# EAGLE design CS_PERF (EAGLE 9.5.0)
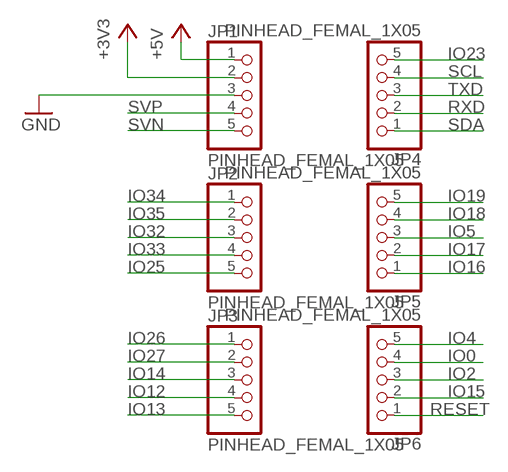
[diagram p0: schematic, sheet 1]

## Parts
JP1  PINHEAD_FEMAL_1X05  [1X05F]
JP2  PINHEAD_FEMAL_1X05  [1X05F]
JP3  PINHEAD_FEMAL_1X05  [1X05F]
JP4  PINHEAD_FEMAL_1X05  [1X05F]
JP5  PINHEAD_FEMAL_1X05  [1X05F]
JP6  PINHEAD_FEMAL_1X05  [1X05F]

## Nets
+3V3: JP1.2
+5V: JP1.1
GND: JP1.3
IO0: JP6.4
IO2: JP6.3
IO4: JP6.5
IO5: JP5.3
IO12: JP3.4
IO13: JP3.5
IO14: JP3.3
IO15: JP6.2
IO16: JP5.1
IO17: JP5.2
IO18: JP5.4
IO19: JP5.5
IO23: JP4.5
IO25: JP2.5
IO26: JP3.1
IO27: JP3.2
IO32: JP2.3
IO33: JP2.4
IO34: JP2.1
IO35: JP2.2
RESET: JP6.1
RXD: JP4.2
SCL: JP4.4
SDA: JP4.1
SVN: JP1.5
SVP: JP1.4
TXD: JP4.3

## Library data of the parts
JP1-JP6 = SamacSys_3D:PINHEAD_FEMAL_1X05

## Board
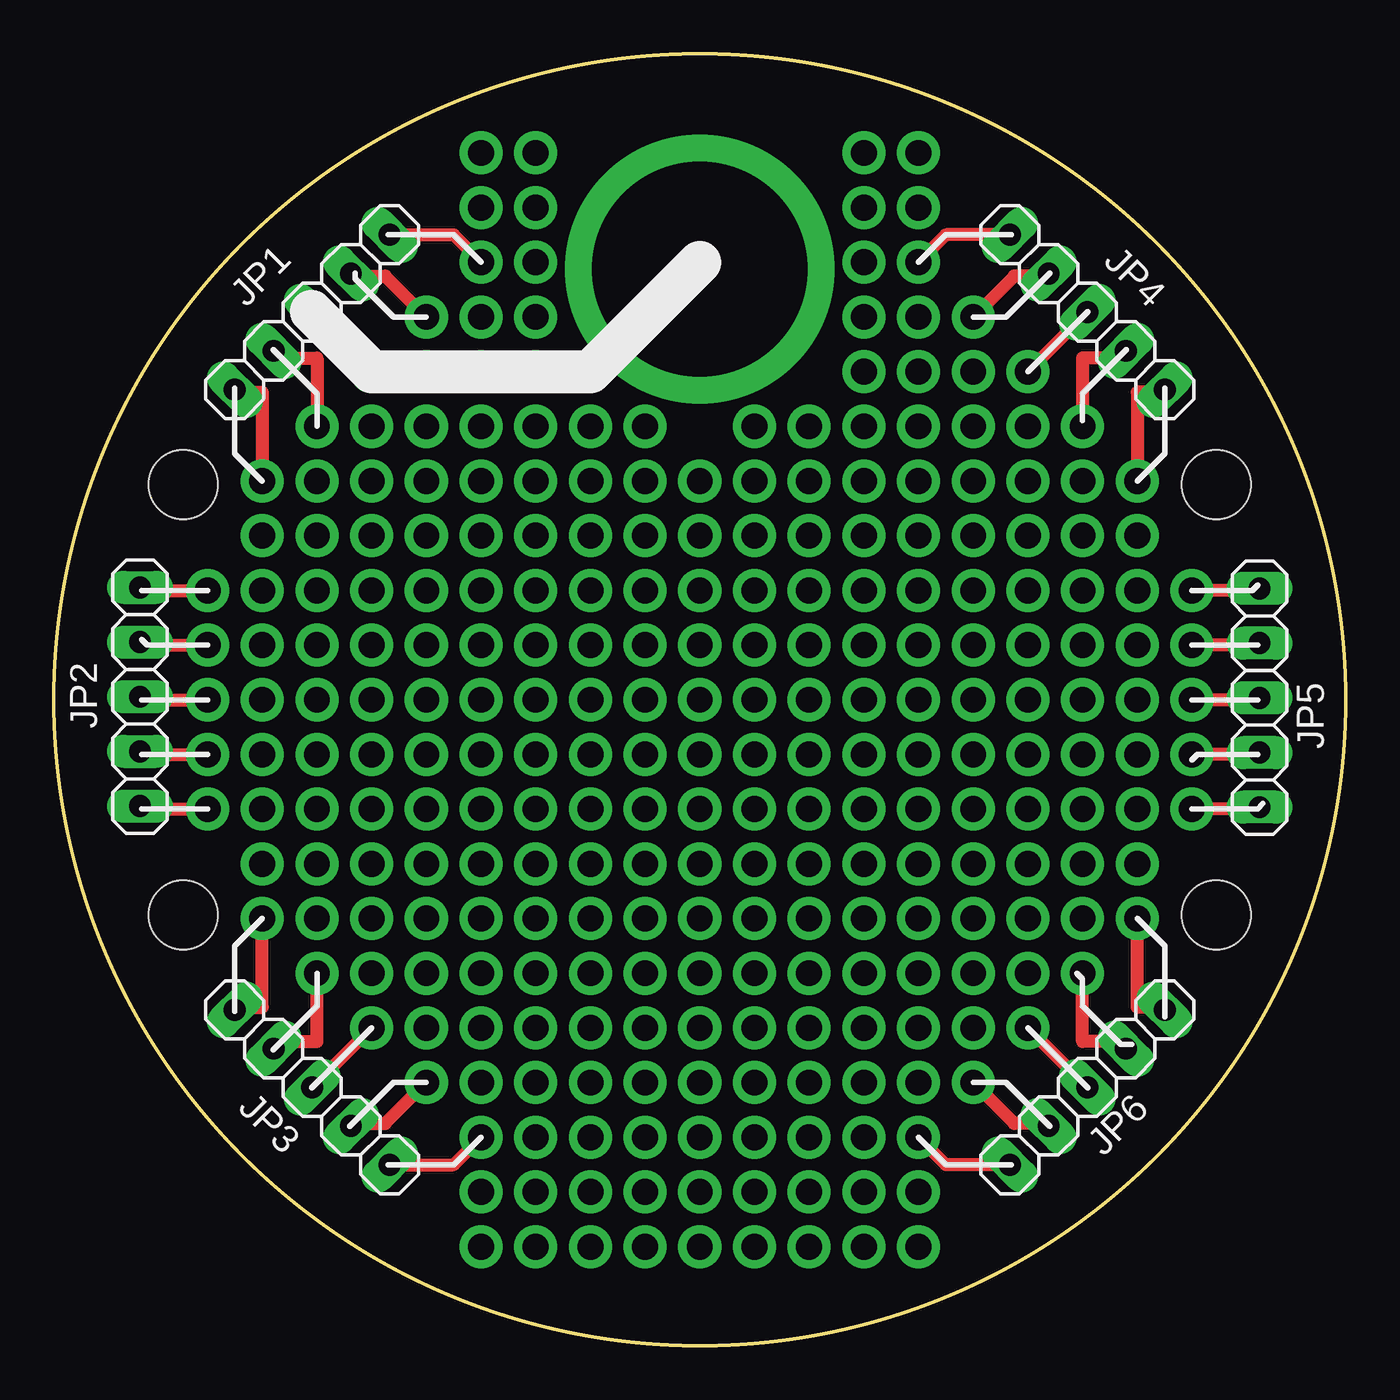
[diagram p1: board, top side]
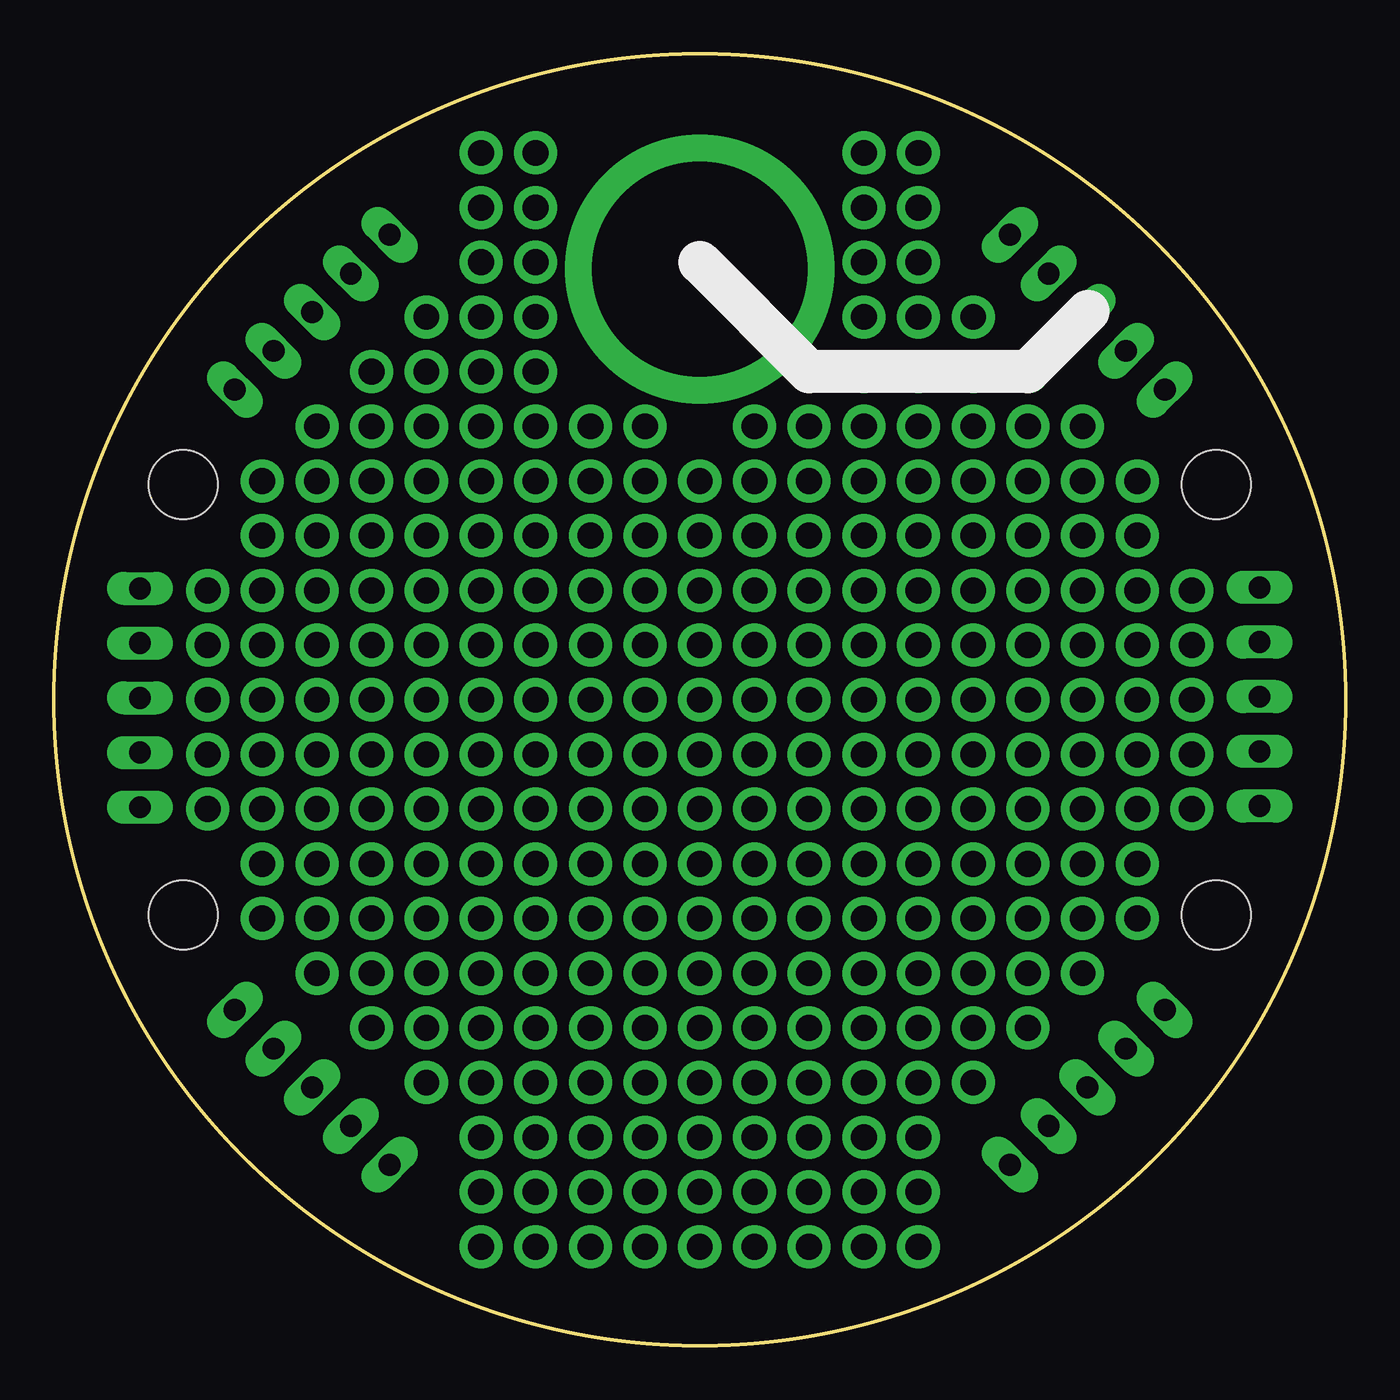
[diagram p2: board, bottom side, seen from below]

Size 60 x 60 mm. Coordinates in mm from the lower left corner, seen from the top.
Outline: circle at 30,30 radius 30
Copper layers (1*16): Top 0.035mm / dielectric 1.5mm / Bottom 0.035mm
Design rules "default *": minimum track width 0.6mm, minimum drill 0.35mm, track to track 10mil, track to pad 10mil, pad to pad 10mil, via to via 10mil, smd to smd 6mil, copper to edge 40mil, drill to drill 8mil, minimum pad ring 10mil, minimum via ring 8mil, stop-mask expansion 6mil, vias tented up to drill 0mil, thermal gap 8mil
Holes 3.2 mm at 6,40 54,40 6,20 54,20

### Footprints (pad centres in the part's own frame; a part is rotated, then mirrored left to right if it is on the bottom)
1X05F = drill 1.016 long: 1 -5.08,0; 2 -2.54,0; 3 0,0; 4 2.54,0; 5 5.08,0

### Placement (x,y rotation side)
JP1  12,48 225 top
JP2  4,30.14 270 top
JP3  12,12 315 top
JP4  48,48 135 top
JP5  56,30.09 90 top
JP6  48,12 45 top

### Tracks (layer width: path | path; a pad name or v marks a point on that pad's centre or on a via)
+3V3  (via drill 1.2 pad 2)
  Top 0.6: v17.3,47.78 15.39,49.69 13.81,49.69 JP1.2
+5V  (via drill 1.2 pad 2)
  Top 0.6: v19.84,50.32 18.57,51.59 15.71,51.59 JP1.1
GND  (via drill 1.2 pad 2, 10 pad 12.5)
  Top 0.6: v30,50 29.84,50.16
  Top 1: 30,50.32 29.84,50.16 24.92,45.24 v22.38,45.24 v19.84,45.24 v17.3,45.24 v14.76,45.24 JP1.3
  Bottom 1: 30,50.32 24.92,45.24 v22.38,45.24 v19.84,45.24 v17.3,45.24 v14.76,45.24 JP1.3
IO0  (via drill 1.2 pad 2)
  Top 0.6: v47.78,17.3 47.78,14.12 49.37,14.12 49.69,13.81 JP6.4
IO2  (via drill 1.2 pad 2)
  Top 0.6: JP6.3 v45.24,14.76
IO4  (via drill 1.2 pad 2)
  Top 0.6: v50.32,19.84 50.32,15.71 51.59,15.71 JP6.5
IO5  (via drill 1.2 pad 2)
  Top 0.6: v52.86,30 55.72,30 JP5.3
IO12  (via drill 1.2 pad 2)
  Top 0.6: v17.3,12.22 15.39,10.32 13.81,10.32 JP3.4
IO13  (via drill 1.2 pad 2)
  Top 0.6: v19.84,9.68 18.57,8.41 15.71,8.41 JP3.5
IO14  (via drill 1.2 pad 2)
  Top 0.6: JP3.3 v14.76,14.76
IO15  (via drill 1.2 pad 2)
  Top 0.6: v42.7,12.22 44.61,10.32 46.19,10.32 JP6.2
IO16  (via drill 1.2 pad 2)
  Top 0.6: v52.86,24.92 55.72,24.92 JP5.1
IO17  (via drill 1.2 pad 2)
  Top 0.6: v52.86,27.46 55.72,27.46 JP5.2
IO18  (via drill 1.2 pad 2)
  Top 0.6: v52.86,32.54 55.72,32.54 JP5.4
IO19  (via drill 1.2 pad 2)
  Top 0.6: v52.86,35.08 55.72,35.08 JP5.5
IO23  (via drill 1.2 pad 2)
  Top 0.6: v40.16,50.32 41.43,51.59 44.29,51.59 JP4.5
IO25  (via drill 1.2 pad 2)
  Top 0.6: v7.14,24.92 4.28,24.92 JP2.5
IO26  (via drill 1.2 pad 2)
  Top 0.6: v9.68,19.84 9.68,15.71 8.41,15.71 JP3.1
IO27  (via drill 1.2 pad 2)
  Top 0.6: v12.22,17.3 12.22,14.12 10.63,14.12 10.32,13.81 JP3.2
IO32  (via drill 1.2 pad 2)
  Top 0.6: v7.14,30 4.28,30 JP2.3
IO33  (via drill 1.2 pad 2)
  Top 0.6: v7.14,27.46 4.28,27.46 JP2.4
IO34  (via drill 1.2 pad 2)
  Top 0.6: v7.14,35.08 4.28,35.08 JP2.1
IO35  (via drill 1.2 pad 2)
  Top 0.6: v7.14,32.54 4.28,32.54 JP2.2
N$1  (via drill 1.2 pad 2)
  other vias: 30,30
N$3  (via drill 1.2 pad 2)
  other vias: 19.84,47.78
N$4  (via drill 1.2 pad 2)
  other vias: 32.54,30
N$5  (via drill 1.2 pad 2)
  other vias: 27.46,30
N$6  (via drill 1.2 pad 2)
  other vias: 30,27.46
N$7  (via drill 1.2 pad 2)
  other vias: 22.38,50.32
N$8  (via drill 1.2 pad 2)
  other vias: 22.38,47.78
N$9  (via drill 1.2 pad 2)
  other vias: 37.62,50.32
N$10  (via drill 1.2 pad 2)
  other vias: 37.62,47.78
N$11  (via drill 1.2 pad 2)
  other vias: 40.16,47.78
N$12  (via drill 1.2 pad 2)
  other vias: 37.62,45.24
N$13  (via drill 1.2 pad 2)
  other vias: 40.16,45.24
N$14  (via drill 1.2 pad 2)
  other vias: 42.7,45.24
N$15  (via drill 1.2 pad 2)
  other vias: 14.76,42.7
N$16  (via drill 1.2 pad 2)
  other vias: 17.3,42.7
N$17  (via drill 1.2 pad 2)
  other vias: 19.84,42.7
N$18  (via drill 1.2 pad 2)
  other vias: 22.38,42.7
N$19  (via drill 1.2 pad 2)
  other vias: 24.92,42.7
N$20  (via drill 1.2 pad 2)
  other vias: 27.46,42.7
N$22  (via drill 1.2 pad 2)
  other vias: 32.54,42.7
N$23  (via drill 1.2 pad 2)
  other vias: 35.08,42.7
N$24  (via drill 1.2 pad 2)
  other vias: 37.62,42.7
N$25  (via drill 1.2 pad 2)
  other vias: 40.16,42.7
N$26  (via drill 1.2 pad 2)
  other vias: 42.7,42.7
N$27  (via drill 1.2 pad 2)
  other vias: 45.24,42.7
N$28  (via drill 1.2 pad 2)
  other vias: 12.22,40.16
N$29  (via drill 1.2 pad 2)
  other vias: 14.76,40.16
N$30  (via drill 1.2 pad 2)
  other vias: 17.3,40.16
N$31  (via drill 1.2 pad 2)
  other vias: 19.84,40.16
N$32  (via drill 1.2 pad 2)
  other vias: 22.38,40.16
N$33  (via drill 1.2 pad 2)
  other vias: 24.92,40.16
N$34  (via drill 1.2 pad 2)
  other vias: 27.46,40.16
N$35  (via drill 1.2 pad 2)
  other vias: 30,40.16
N$36  (via drill 1.2 pad 2)
  other vias: 32.54,40.16
N$37  (via drill 1.2 pad 2)
  other vias: 35.08,40.16
N$38  (via drill 1.2 pad 2)
  other vias: 37.62,40.16
N$39  (via drill 1.2 pad 2)
  other vias: 40.16,40.16
N$40  (via drill 1.2 pad 2)
  other vias: 42.7,40.16
N$41  (via drill 1.2 pad 2)
  other vias: 45.24,40.16
N$42  (via drill 1.2 pad 2)
  other vias: 47.78,40.16
N$43  (via drill 1.2 pad 2)
  other vias: 9.68,37.62
N$44  (via drill 1.2 pad 2)
  other vias: 12.22,37.62
N$45  (via drill 1.2 pad 2)
  other vias: 9.68,35.08
N$46  (via drill 1.2 pad 2)
  other vias: 9.68,32.54
N$47  (via drill 1.2 pad 2)
  other vias: 9.68,30
N$48  (via drill 1.2 pad 2)
  other vias: 9.68,27.46
N$49  (via drill 1.2 pad 2)
  other vias: 9.68,24.92
N$50  (via drill 1.2 pad 2)
  other vias: 9.68,22.38
N$51  (via drill 1.2 pad 2)
  other vias: 12.22,19.84
N$52  (via drill 1.2 pad 2)
  other vias: 14.76,17.3
N$53  (via drill 1.2 pad 2)
  other vias: 17.3,14.76
N$54  (via drill 1.2 pad 2)
  other vias: 19.84,12.22
N$55  (via drill 1.2 pad 2)
  other vias: 22.38,9.68
N$56  (via drill 1.2 pad 2)
  other vias: 24.92,9.68
N$57  (via drill 1.2 pad 2)
  other vias: 27.46,9.68
N$58  (via drill 1.2 pad 2)
  other vias: 30,9.68
N$59  (via drill 1.2 pad 2)
  other vias: 32.54,9.68
N$60  (via drill 1.2 pad 2)
  other vias: 35.08,9.68
N$61  (via drill 1.2 pad 2)
  other vias: 37.62,9.68
N$62  (via drill 1.2 pad 2)
  other vias: 40.16,12.22
N$63  (via drill 1.2 pad 2)
  other vias: 42.7,14.76
N$64  (via drill 1.2 pad 2)
  other vias: 45.24,17.3
N$65  (via drill 1.2 pad 2)
  other vias: 47.78,19.84
N$66  (via drill 1.2 pad 2)
  other vias: 50.32,22.38
N$67  (via drill 1.2 pad 2)
  other vias: 50.32,24.92
N$68  (via drill 1.2 pad 2)
  other vias: 50.32,27.46
N$69  (via drill 1.2 pad 2)
  other vias: 50.32,30
N$70  (via drill 1.2 pad 2)
  other vias: 50.32,32.54
N$71  (via drill 1.2 pad 2)
  other vias: 50.32,35.08
N$72  (via drill 1.2 pad 2)
  other vias: 50.32,37.62
N$73  (via drill 1.2 pad 2)
  other vias: 19.84,7.14
N$74  (via drill 1.2 pad 2)
  other vias: 19.84,4.6
N$75  (via drill 1.2 pad 2)
  other vias: 22.38,4.6
N$76  (via drill 1.2 pad 2)
  other vias: 24.92,4.6
N$77  (via drill 1.2 pad 2)
  other vias: 27.46,4.6
N$78  (via drill 1.2 pad 2)
  other vias: 30,4.6
N$79  (via drill 1.2 pad 2)
  other vias: 32.54,4.6
N$80  (via drill 1.2 pad 2)
  other vias: 35.08,4.6
N$81  (via drill 1.2 pad 2)
  other vias: 37.62,4.6
N$82  (via drill 1.2 pad 2)
  other vias: 40.16,4.6
N$83  (via drill 1.2 pad 2)
  other vias: 40.16,7.14
N$84  (via drill 1.2 pad 2)
  other vias: 37.62,7.14
N$85  (via drill 1.2 pad 2)
  other vias: 35.08,7.14
N$86  (via drill 1.2 pad 2)
  other vias: 30,7.14
N$87  (via drill 1.2 pad 2)
  other vias: 24.92,7.14
N$88  (via drill 1.2 pad 2)
  other vias: 22.38,7.14
N$89  (via drill 1.2 pad 2)
  other vias: 27.46,7.14
N$90  (via drill 1.2 pad 2)
  other vias: 32.54,7.14
N$91  (via drill 1.2 pad 2)
  other vias: 22.38,52.86
N$92  (via drill 1.2 pad 2)
  other vias: 19.84,52.86
N$93  (via drill 1.2 pad 2)
  other vias: 37.62,52.86
N$94  (via drill 1.2 pad 2)
  other vias: 40.16,52.86
N$95  (via drill 1.2 pad 2)
  other vias: 40.16,55.4
N$96  (via drill 1.2 pad 2)
  other vias: 37.62,55.4
N$97  (via drill 1.2 pad 2)
  other vias: 22.38,55.4
N$98  (via drill 1.2 pad 2)
  other vias: 19.84,55.4
N$101  (via drill 1.2 pad 2)
  other vias: 47.78,37.62
N$102  (via drill 1.2 pad 2)
  other vias: 47.78,35.08
N$103  (via drill 1.2 pad 2)
  other vias: 47.78,32.54
N$104  (via drill 1.2 pad 2)
  other vias: 47.78,27.46
N$105  (via drill 1.2 pad 2)
  other vias: 47.78,30
N$106  (via drill 1.2 pad 2)
  other vias: 47.78,24.92
N$107  (via drill 1.2 pad 2)
  other vias: 47.78,22.38
N$108  (via drill 1.2 pad 2)
  other vias: 14.76,37.62
N$109  (via drill 1.2 pad 2)
  other vias: 17.3,37.62
N$110  (via drill 1.2 pad 2)
  other vias: 19.84,37.62
N$111  (via drill 1.2 pad 2)
  other vias: 22.38,37.62
N$112  (via drill 1.2 pad 2)
  other vias: 24.92,37.62
N$113  (via drill 1.2 pad 2)
  other vias: 27.46,37.62
N$114  (via drill 1.2 pad 2)
  other vias: 30,37.62
N$115  (via drill 1.2 pad 2)
  other vias: 32.54,37.62
N$116  (via drill 1.2 pad 2)
  other vias: 35.08,37.62
N$117  (via drill 1.2 pad 2)
  other vias: 37.62,37.62
N$118  (via drill 1.2 pad 2)
  other vias: 40.16,37.62
N$119  (via drill 1.2 pad 2)
  other vias: 42.7,37.62
N$120  (via drill 1.2 pad 2)
  other vias: 45.24,37.62
N$121  (via drill 1.2 pad 2)
  other vias: 45.24,35.08
N$122  (via drill 1.2 pad 2)
  other vias: 42.7,35.08
N$123  (via drill 1.2 pad 2)
  other vias: 40.16,35.08
N$124  (via drill 1.2 pad 2)
  other vias: 35.08,35.08
N$125  (via drill 1.2 pad 2)
  other vias: 37.62,35.08
N$126  (via drill 1.2 pad 2)
  other vias: 32.54,35.08
N$127  (via drill 1.2 pad 2)
  other vias: 30,35.08
N$128  (via drill 1.2 pad 2)
  other vias: 27.46,35.08
N$129  (via drill 1.2 pad 2)
  other vias: 24.92,35.08
N$130  (via drill 1.2 pad 2)
  other vias: 22.38,35.08
N$131  (via drill 1.2 pad 2)
  other vias: 17.3,35.08
N$132  (via drill 1.2 pad 2)
  other vias: 19.84,35.08
N$133  (via drill 1.2 pad 2)
  other vias: 14.76,35.08
N$134  (via drill 1.2 pad 2)
  other vias: 12.22,35.08
N$135  (via drill 1.2 pad 2)
  other vias: 12.22,32.54
N$136  (via drill 1.2 pad 2)
  other vias: 14.76,32.54
N$137  (via drill 1.2 pad 2)
  other vias: 17.3,32.54
N$138  (via drill 1.2 pad 2)
  other vias: 19.84,32.54
N$139  (via drill 1.2 pad 2)
  other vias: 22.38,32.54
N$140  (via drill 1.2 pad 2)
  other vias: 24.92,32.54
N$141  (via drill 1.2 pad 2)
  other vias: 27.46,32.54
N$142  (via drill 1.2 pad 2)
  other vias: 30,32.54
N$143  (via drill 1.2 pad 2)
  other vias: 32.54,32.54
N$144  (via drill 1.2 pad 2)
  other vias: 35.08,32.54
N$145  (via drill 1.2 pad 2)
  other vias: 37.62,32.54
N$146  (via drill 1.2 pad 2)
  other vias: 40.16,32.54
N$147  (via drill 1.2 pad 2)
  other vias: 42.7,32.54
N$148  (via drill 1.2 pad 2)
  other vias: 45.24,32.54
N$149  (via drill 1.2 pad 2)
  other vias: 45.24,30
N$150  (via drill 1.2 pad 2)
  other vias: 42.7,30
N$151  (via drill 1.2 pad 2)
  other vias: 40.16,30
N$152  (via drill 1.2 pad 2)
  other vias: 37.62,30
N$153  (via drill 1.2 pad 2)
  other vias: 35.08,30
N$154  (via drill 1.2 pad 2)
  other vias: 24.92,30
N$155  (via drill 1.2 pad 2)
  other vias: 22.38,30
N$156  (via drill 1.2 pad 2)
  other vias: 19.84,30
N$157  (via drill 1.2 pad 2)
  other vias: 17.3,30
N$158  (via drill 1.2 pad 2)
  other vias: 14.76,30
N$159  (via drill 1.2 pad 2)
  other vias: 12.22,30
N$160  (via drill 1.2 pad 2)
  other vias: 12.22,27.46
N$161  (via drill 1.2 pad 2)
  other vias: 14.76,27.46
N$162  (via drill 1.2 pad 2)
  other vias: 17.3,27.46
N$163  (via drill 1.2 pad 2)
  other vias: 22.38,27.46
N$164  (via drill 1.2 pad 2)
  other vias: 19.84,27.46
N$165  (via drill 1.2 pad 2)
  other vias: 24.92,27.46
N$166  (via drill 1.2 pad 2)
  other vias: 27.46,27.46
N$167  (via drill 1.2 pad 2)
  other vias: 32.54,27.46
N$168  (via drill 1.2 pad 2)
  other vias: 35.08,27.46
N$169  (via drill 1.2 pad 2)
  other vias: 37.62,27.46
N$170  (via drill 1.2 pad 2)
  other vias: 40.16,27.46
N$171  (via drill 1.2 pad 2)
  other vias: 42.7,27.46
N$172  (via drill 1.2 pad 2)
  other vias: 45.24,27.46
N$173  (via drill 1.2 pad 2)
  other vias: 45.24,24.92
N$174  (via drill 1.2 pad 2)
  other vias: 42.7,24.92
N$175  (via drill 1.2 pad 2)
  other vias: 40.16,24.92
N$176  (via drill 1.2 pad 2)
  other vias: 37.62,24.92
N$177  (via drill 1.2 pad 2)
  other vias: 35.08,24.92
N$178  (via drill 1.2 pad 2)
  other vias: 30,24.92
N$179  (via drill 1.2 pad 2)
  other vias: 27.46,24.92
N$180  (via drill 1.2 pad 2)
  other vias: 24.92,24.92
N$181  (via drill 1.2 pad 2)
  other vias: 19.84,24.92
N$182  (via drill 1.2 pad 2)
  other vias: 17.3,24.92
N$183  (via drill 1.2 pad 2)
  other vias: 12.22,24.92
N$184  (via drill 1.2 pad 2)
  other vias: 14.76,24.92
N$185  (via drill 1.2 pad 2)
  other vias: 22.38,24.92
N$186  (via drill 1.2 pad 2)
  other vias: 32.54,24.92
N$187  (via drill 1.2 pad 2)
  other vias: 12.22,22.38
N$188  (via drill 1.2 pad 2)
  other vias: 14.76,22.38
N$189  (via drill 1.2 pad 2)
  other vias: 19.84,22.38
N$190  (via drill 1.2 pad 2)
  other vias: 22.38,22.38
N$191  (via drill 1.2 pad 2)
  other vias: 27.46,22.38
N$192  (via drill 1.2 pad 2)
  other vias: 30,22.38
N$193  (via drill 1.2 pad 2)
  other vias: 32.54,22.38
N$194  (via drill 1.2 pad 2)
  other vias: 35.08,22.38
N$195  (via drill 1.2 pad 2)
  other vias: 37.62,22.38
N$196  (via drill 1.2 pad 2)
  other vias: 40.16,22.38
N$197  (via drill 1.2 pad 2)
  other vias: 42.7,22.38
N$198  (via drill 1.2 pad 2)
  other vias: 45.24,22.38
N$199  (via drill 1.2 pad 2)
  other vias: 24.92,22.38
N$200  (via drill 1.2 pad 2)
  other vias: 17.3,22.38
N$201  (via drill 1.2 pad 2)
  other vias: 14.76,19.84
N$202  (via drill 1.2 pad 2)
  other vias: 17.3,19.84
N$203  (via drill 1.2 pad 2)
  other vias: 19.84,19.84
N$204  (via drill 1.2 pad 2)
  other vias: 24.92,19.84
N$205  (via drill 1.2 pad 2)
  other vias: 27.46,19.84
N$206  (via drill 1.2 pad 2)
  other vias: 32.54,19.84
N$207  (via drill 1.2 pad 2)
  other vias: 37.62,19.84
N$208  (via drill 1.2 pad 2)
  other vias: 40.16,19.84
N$209  (via drill 1.2 pad 2)
  other vias: 42.7,19.84
N$210  (via drill 1.2 pad 2)
  other vias: 45.24,19.84
N$211  (via drill 1.2 pad 2)
  other vias: 35.08,19.84
N$212  (via drill 1.2 pad 2)
  other vias: 30,19.84
N$213  (via drill 1.2 pad 2)
  other vias: 22.38,19.84
N$214  (via drill 1.2 pad 2)
  other vias: 17.3,17.3
N$215  (via drill 1.2 pad 2)
  other vias: 19.84,17.3
N$216  (via drill 1.2 pad 2)
  other vias: 22.38,17.3
N$217  (via drill 1.2 pad 2)
  other vias: 24.92,17.3
N$218  (via drill 1.2 pad 2)
  other vias: 27.46,17.3
N$219  (via drill 1.2 pad 2)
  other vias: 30,17.3
N$220  (via drill 1.2 pad 2)
  other vias: 32.54,17.3
N$221  (via drill 1.2 pad 2)
  other vias: 35.08,17.3
N$222  (via drill 1.2 pad 2)
  other vias: 37.62,17.3
N$223  (via drill 1.2 pad 2)
  other vias: 40.16,17.3
N$224  (via drill 1.2 pad 2)
  other vias: 42.7,17.3
N$225  (via drill 1.2 pad 2)
  other vias: 40.16,14.76
N$226  (via drill 1.2 pad 2)
  other vias: 37.62,14.76
N$227  (via drill 1.2 pad 2)
  other vias: 35.08,14.76
N$228  (via drill 1.2 pad 2)
  other vias: 32.54,14.76
N$229  (via drill 1.2 pad 2)
  other vias: 30,14.76
N$230  (via drill 1.2 pad 2)
  other vias: 24.92,14.76
N$231  (via drill 1.2 pad 2)
  other vias: 27.46,14.76
N$232  (via drill 1.2 pad 2)
  other vias: 22.38,14.76
N$233  (via drill 1.2 pad 2)
  other vias: 19.84,14.76
N$234  (via drill 1.2 pad 2)
  other vias: 22.38,12.22
N$235  (via drill 1.2 pad 2)
  other vias: 24.92,12.22
N$236  (via drill 1.2 pad 2)
  other vias: 27.46,12.22
N$237  (via drill 1.2 pad 2)
  other vias: 30,12.22
N$238  (via drill 1.2 pad 2)
  other vias: 35.08,12.22
N$239  (via drill 1.2 pad 2)
  other vias: 32.54,12.22
N$240  (via drill 1.2 pad 2)
  other vias: 37.62,12.22
RESET  (via drill 1.2 pad 2)
  Top 0.6: v40.16,9.68 41.43,8.41 44.29,8.41 JP6.1
RXD  (via drill 1.2 pad 2)
  Top 0.6: v47.78,42.7 47.78,45.88 49.37,45.88 49.69,46.19 JP4.2
SCL  (via drill 1.2 pad 2)
  Top 0.6: v42.7,47.78 44.61,49.69 46.19,49.69 JP4.4
SDA  (via drill 1.2 pad 2)
  Top 0.6: v50.32,40.16 50.32,44.29 51.59,44.29 JP4.1
SVN  (via drill 1.2 pad 2)
  Top 0.6: v9.68,40.16 9.68,44.29 8.41,44.29 JP1.5
SVP  (via drill 1.2 pad 2)
  Top 0.6: v12.22,42.7 12.22,45.88 10.63,45.88 10.32,46.19 JP1.4
TXD  (via drill 1.2 pad 2)
  Top 0.6: JP4.3 v45.24,45.24